# Altium schematic sheet Power.SchDoc
size A4; DocumentNumber: 4; SheetNumber: 4; SheetTotal: 4
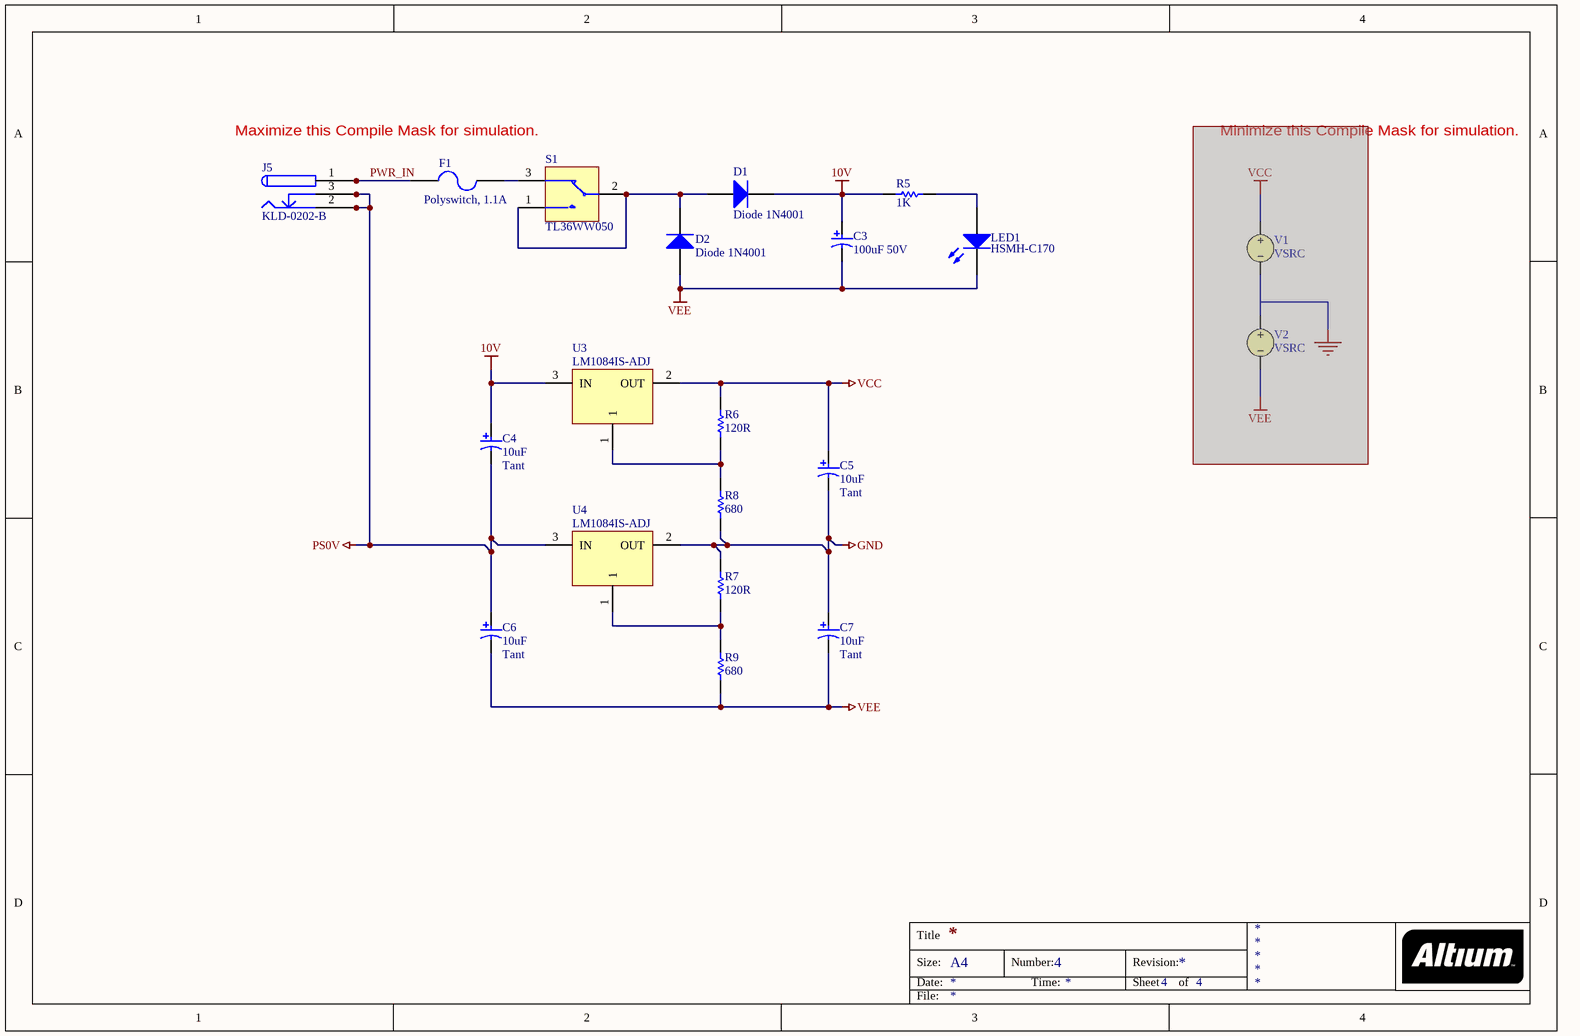
[diagram p0: Power.SchDoc]

## Parts
C3  100uF 50V  [MCCT-B]
C4  10uF  Capacitor Type: Tant  [MCCT-B]
C5  10uF  Capacitor Type: Tant  [MCCT-B]
C6  10uF  Capacitor Type: Tant  [MCCT-B]
C7  10uF  Capacitor Type: Tant  [MCCT-B]
D1  Diode 1N4001  [DO-41]
D2  Diode 1N4001  [DO-41]
F1  Polyswitch, 1.1A  [PIN-W2/E2.8]
J5  KLD-0202-B  [KLD-0202]
LED1  HSMH-C170  [SMD _LED]
R5  1K  [3216[1206]]
R6  120R  [3216[1206]]
R7  120R  [3216[1206]]
R8  680  [3216[1206]]
R9  680  [3216[1206]]
S1  TL36WW050  [B3FS_SWITCH]
U3  LM1084IS-ADJ  [TO-263]
U4  LM1084IS-ADJ  [TO-263]
V1  VSRC  (masked out: inside a compile mask, not in the netlist)
V2  VSRC  (masked out: inside a compile mask, not in the netlist)

## Nets
10V: C3.1 C4.1 D1.2(K) R5.2 U3.3(IN)
GND: C5.2 C7.1 R7.1 R8.2 U4.2(OUT)
PS0V: C4.2 C6.1 J5.2 J5.2A J5.2B J5.3 J5.3A J5.3B U4.3(IN)
VCC: C5.1 R6.1 U3.2(OUT)
VEE: C3.2 C6.2 C7.2 D2.1(A) LED1.2(K) R9.2
PWR_IN: F1.1 J5.1 J5.1A J5.1B
NetD1_1: D1.1(A) D2.2(K) S1.1 S1.2
NetF1_2: F1.2 S1.3
NetLED1_1: LED1.1(A) R5.1
NetR6_2: R6.2 R8.1 U3.1
NetR7_2: R7.2 R9.1 U4.1

## Notes on the sheet
- Maximize this Compile Mask for simulation.
- Minimize this Compile Mask for simulation.
- Title
- Size:
- Date:
- A4
- Number:
- Time:
- Revision:
- Sheet
- of
- File:

## Library data of the parts
C3 = CAP_POLAR: Polar Capacitor
C4-C7 = CAP_POLAR: Polar Capacitor; AEMS Code: 2100110; Supplier: FARNELL; Supplier Code: 967-117
D1 D2 = Diode 1N4001: 1 Amp General Purpose Rectifier; Published: 8-Jun-2000; LatestRevisionDate: 17-Jul-2002; LatestRevisionNote: Re-released for DXP Platform.; DatasheetVersion: 1998; PackageVersion: Aug-1999; PackageReference: DO-41; Publisher: Altium Limited; PackageDescription: Diode, Axial; Body 5.2 x 2.7 mm (LxDia. max), Lead Dia. 0.86 mm (max); Code_JEDEC: DO-204-AL; ComponentLink1Description: Manufacturer Link; ComponentLink1URL: http://www.fairchildsemi.com/; ComponentLink2Description: Datasheet; ComponentLink2URL: http://www.fairchildsemi.com/ds/1N%2F1N4001.pdf
F1 = Fuse 2: Polyswitch 1.1A, Raychem RUE110; Revision: July-2002: Re-released for DXP Platform.; Supplier: FARNELL; Supplier Code: 608-907
J5 = KLD-0202-B: Low Voltage Power Supply Connector; Manufacturer: Kycon; AEMS Code: 3510211
LED1 = HSMX-C670: Typical RED GaAs SMD LED Agilent make; AEMS Code: 2610081; Revision: July-2002: Re-released for DXP Platform.
R5 = RES: Resistor; AEMS Code: 1200430
R6-R9 = Res1: Resistor; Published: 8-Jun-2000; LatestRevisionDate: 17-Jul-2002; LatestRevisionNote: Re-released for DXP Platform.; Publisher: Altium Limited
  R6 R7: Value: 120R
  R8 R9: Value: 680
S1 = PCB_MOUNT_SWITCH: SPDT Subminiature Toggle Switch; Supplier: FARNELL; Supplier Code: 150-559
U3 U4 = LM1084IS-ADJ: 5A Low Dropout Possitive Regulators
V1 = VSRC: Voltage Source; Note: PCB Footprint - Not required; Value: 8V; Published: 8-Jun-2000; LatestRevisionDate: 17-Jul-2002; LatestRevisionNote: Re-released for DXP Platform.; PackageReference: Not Applicable; Publisher: Altium Limited
V2 = VSRC: Voltage Source; Note: PCB Footprint - Not required; Value: 8; Published: 8-Jun-2000; LatestRevisionDate: 17-Jul-2002; LatestRevisionNote: Re-released for DXP Platform.; PackageReference: Not Applicable; Publisher: Altium Limited